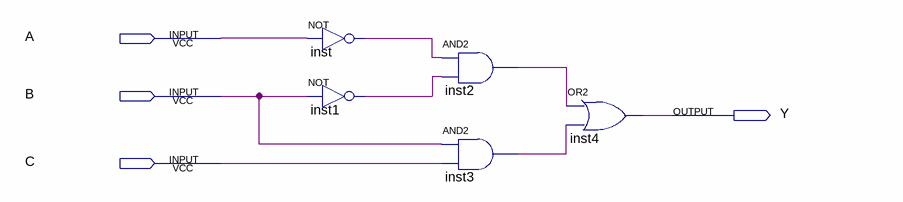
[diagram p0: schematic sheet]
// Quartus schematic questao2_A.bdf as structural Verilog: 5 symbols, 4 pins
module questao2_A (
  input  A,
  input  B,
  input  C,
  output Y
);

  wire inst1_out, inst2_out, inst3_out, inst_out;

  not inst (inst_out, A);
  not inst1 (inst1_out, B);
  and inst2 (inst2_out, inst_out, inst1_out);
  and inst3 (inst3_out, B, C);
  or inst4 (Y, inst2_out, inst3_out);
endmodule
